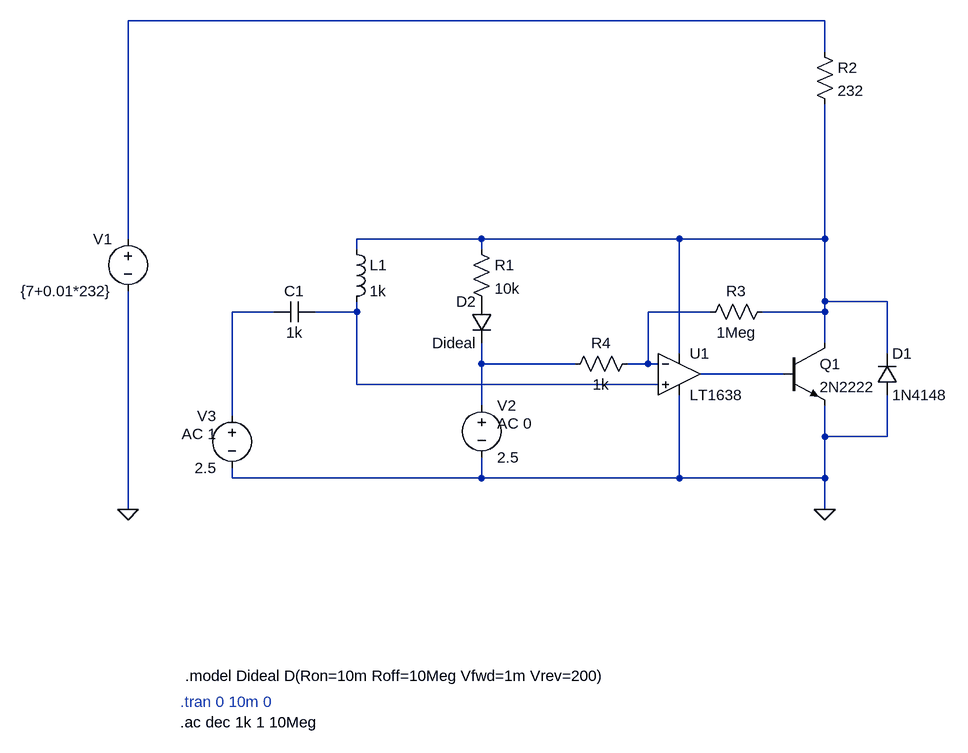
[diagram p0: schematic TL431_Test_Bench.asc]
TL431_Test_Bench.asc, the LTspice schematic file:
Version 4.1
SHEET 1 1076 680
WIRE 816 -800 -256 -800
WIRE 816 -752 816 -800
WIRE -256 -464 -256 -800
WIRE 288 -464 96 -464
WIRE 592 -464 288 -464
WIRE 816 -464 816 -672
WIRE 816 -464 592 -464
WIRE 96 -448 96 -464
WIRE 288 -448 288 -464
WIRE 816 -368 816 -464
WIRE 912 -368 816 -368
WIRE -32 -352 -96 -352
WIRE 96 -352 96 -368
WIRE 96 -352 32 -352
WIRE 640 -352 544 -352
WIRE 816 -352 816 -368
WIRE 816 -352 720 -352
WIRE 816 -304 816 -352
WIRE 592 -288 592 -464
WIRE 912 -288 912 -368
WIRE 288 -272 288 -304
WIRE 432 -272 288 -272
WIRE 544 -272 544 -352
WIRE 544 -272 512 -272
WIRE 560 -272 544 -272
WIRE 752 -256 624 -256
WIRE 96 -240 96 -352
WIRE 560 -240 96 -240
WIRE 288 -208 288 -272
WIRE -96 -192 -96 -352
WIRE 816 -160 816 -208
WIRE 912 -160 912 -224
WIRE 912 -160 816 -160
WIRE -96 -96 -96 -112
WIRE 288 -96 288 -128
WIRE 288 -96 -96 -96
WIRE 592 -96 592 -224
WIRE 592 -96 288 -96
WIRE 816 -96 816 -160
WIRE 816 -96 592 -96
WIRE -256 -48 -256 -384
WIRE 816 -48 816 -96
FLAG 816 -48 0
FLAG -256 -48 0
DATAFLAG 608 -464 ""
DATAFLAG 160 -240 ""
DATAFLAG 368 -272 ""
SYMBOL npn 752 -304 R0
SYMATTR InstName Q1
SYMATTR Value 2N2222
SYMBOL res 800 -768 R0
SYMATTR InstName R2
SYMATTR Value 232
SYMBOL voltage -256 -480 M0
WINDOW 123 0 0 Left 0
WINDOW 39 0 0 Left 0
SYMATTR InstName V1
SYMATTR Value {7+0.01*232}
SYMBOL diode 896 -224 M180
WINDOW 0 24 64 Left 2
WINDOW 3 24 0 Left 2
SYMATTR InstName D1
SYMATTR Value 1N4148
SYMBOL diode 304 -368 M0
SYMATTR InstName D2
SYMATTR Value Dideal
SYMBOL voltage 288 -224 R0
WINDOW 123 24 44 Left 2
WINDOW 39 0 0 Left 0
SYMATTR Value2 AC 0
SYMATTR InstName V2
SYMATTR Value 2.5
SYMBOL res 272 -464 R0
SYMATTR InstName R1
SYMATTR Value 10k
SYMBOL voltage -96 -208 M0
WINDOW 123 24 44 Left 2
WINDOW 39 0 0 Left 0
SYMATTR Value2 AC 1
SYMATTR InstName V3
SYMATTR Value 2.5
SYMBOL ind 80 -464 R0
SYMATTR InstName L1
SYMATTR Value 1k
SYMBOL cap 32 -368 R90
WINDOW 0 0 32 VBottom 2
WINDOW 3 32 32 VTop 2
SYMATTR InstName C1
SYMATTR Value 1k
SYMBOL OpAmps\\LT1638 592 -320 R0
SYMATTR InstName U1
SYMBOL res 736 -368 R90
WINDOW 0 0 56 VBottom 2
WINDOW 3 32 56 VTop 2
SYMATTR InstName R3
SYMATTR Value 1Meg
SYMBOL res 528 -288 R90
WINDOW 0 0 56 VBottom 2
WINDOW 3 32 56 VTop 2
SYMATTR InstName R4
SYMATTR Value 1k
TEXT -176 280 Left 2 !.ac dec 1k 1 10Meg
TEXT -176 248 Left 2 ;.tran 0 10m 0
TEXT -168 208 Left 2 !.model Dideal D(Ron=10m Roff=10Meg Vfwd=1m Vrev=200)

The netlist it stands for:
* TL431_Test_Bench.asc
Q1 N002 N007 0 0 2N2222
R2 N001 N002 232
V1 N001 0 {7+0.01*232}
D1 0 N002 1N4148
D2 P001 N006 Dideal
V2 N006 0 2.5 AC 0
R1 N002 P001 10k
V3 N003 0 2.5 AC 1
L1 N002 N004 1k
C1 N004 N003 1k
X§U1 N004 N005 N002 0 N007 LT1638  ; pins In+ In- V+ V- OUT
R3 N002 N005 1Meg
R4 N005 N006 1k
.model D D
.lib standard.dio
.model NPN NPN
.model PNP PNP
.lib standard.bjt
.ac dec 1k 1 10Meg
* .tran 0 10m 0
.model Dideal D(Ron=10m Roff=10Meg Vfwd=1m Vrev=200)
.backanno
.end